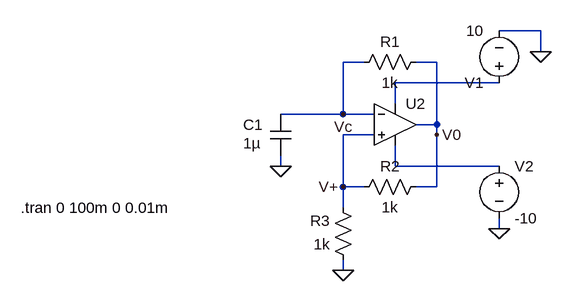
[diagram p0: schematic ideal_rc_osc.asc]
ideal_rc_osc.asc, the LTspice schematic file:
Version 4
SHEET 1 880 680
WIRE 496 0 432 0
WIRE 496 32 496 0
WIRE 224 48 192 48
WIRE 336 48 304 48
WIRE 432 80 272 80
WIRE 272 112 272 80
WIRE 192 128 192 48
WIRE 192 128 96 128
WIRE 240 128 192 128
WIRE 336 144 336 48
WIRE 336 144 304 144
WIRE 240 160 192 160
WIRE 336 160 336 144
WIRE 96 208 96 192
WIRE 272 208 272 176
WIRE 432 208 272 208
WIRE 192 240 192 160
WIRE 224 240 192 240
WIRE 336 240 336 160
WIRE 336 240 304 240
WIRE 192 272 192 240
WIRE 432 304 432 288
WIRE 192 368 192 352
FLAG 192 368 0
FLAG 96 208 0
FLAG 336 160 V0
FLAG 192 128 Vc
FLAG 192 240 V+
FLAG 432 304 0
FLAG 496 32 0
SYMBOL res 320 32 R90
WINDOW 0 0 56 VBottom 2
WINDOW 3 32 56 VTop 2
SYMATTR InstName R1
SYMATTR Value 1k
SYMBOL res 320 224 R90
WINDOW 0 0 56 VBottom 2
WINDOW 3 32 56 VTop 2
SYMATTR InstName R2
SYMATTR Value 1k
SYMBOL res 208 368 R180
WINDOW 0 36 76 Left 2
WINDOW 3 36 40 Left 2
SYMATTR InstName R3
SYMATTR Value 1k
SYMBOL cap 80 128 R0
WINDOW 0 -42 16 Left 2
WINDOW 3 -42 45 Left 2
SYMATTR InstName C1
SYMATTR Value 1µ
SYMBOL OpAmps\\UniversalOpAmp2 272 144 R0
SYMATTR InstName U2
SYMBOL voltage 432 96 R180
WINDOW 123 0 0 Left 0
WINDOW 39 0 0 Left 0
SYMATTR InstName V1
SYMATTR Value 10
SYMBOL voltage 432 192 R0
WINDOW 123 0 0 Left 0
WINDOW 39 0 0 Left 0
SYMATTR InstName V2
SYMATTR Value -10
TEXT -304 272 Left 2 !.tran 0 100m 0 0.01m

The netlist it stands for:
* ideal_rc_osc.asc
R1 V0 Vc 1k
R2 V0 V+ 1k
R3 0 V+ 1k
C1 Vc 0 1µ
XU2 V+ Vc N001 N002 V0 level2 Avol=1Meg GBW=10Meg Slew=10Meg Ilimit=25m Rail=0 Vos=0 En=0 Enk=0 In=0 Ink=0 Rin=500Meg  ; pins In+ In- V+ V- OUT
V1 N001 0 10
V2 N002 0 -10
.tran 0 100m 0 0.01m
.lib UniversalOpAmp2.lib
.backanno
.end